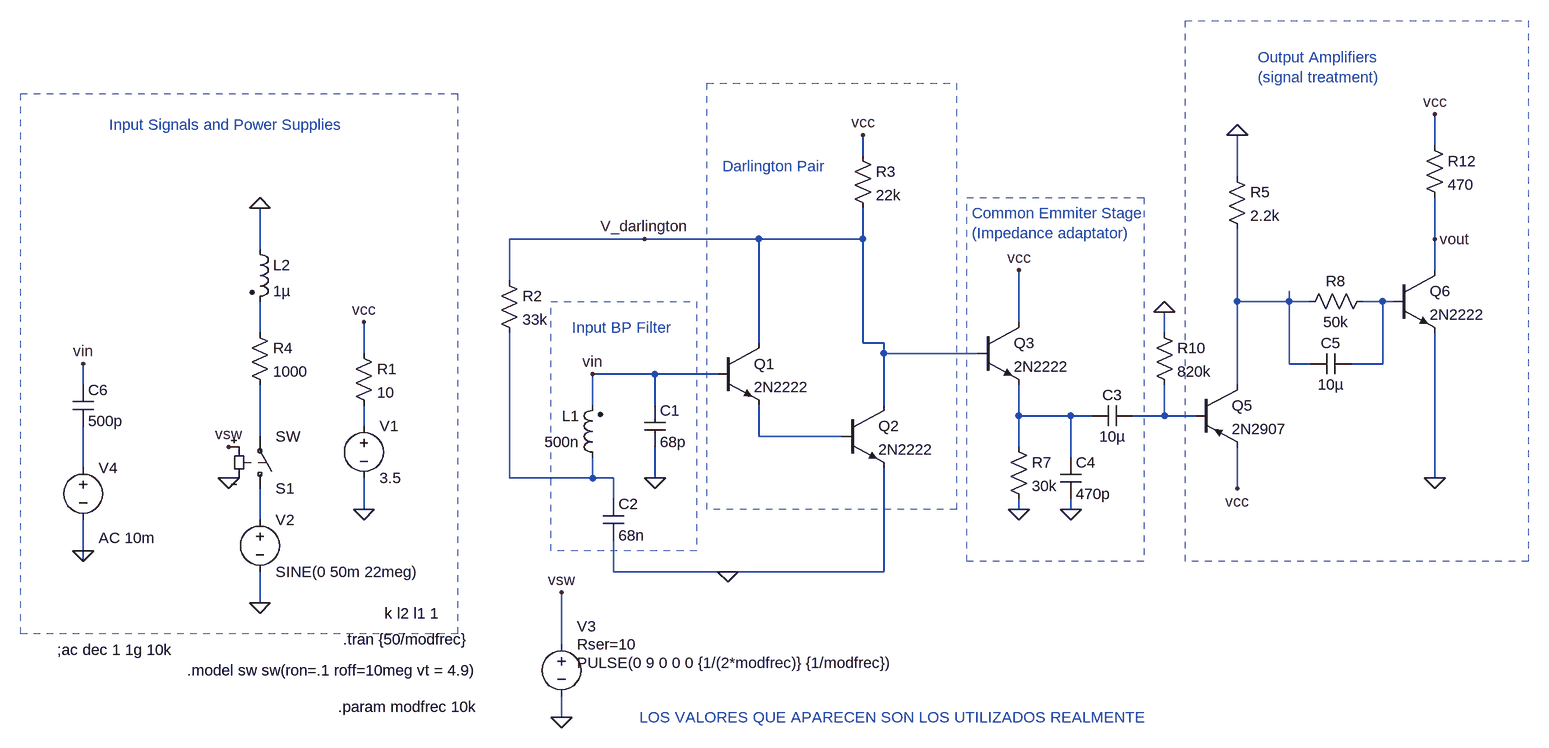
[diagram p0: schematic radio_2.asc]
radio_2.asc, the LTspice schematic file:
Version 4
SHEET 1 2164 724
WIRE 1088 -208 1088 -256
WIRE 208 -192 208 -224
WIRE 784 -160 784 -224
WIRE -128 -64 -336 -64
WIRE 48 -64 -128 -64
WIRE 208 -64 208 -112
WIRE 208 -64 48 -64
WIRE 1088 -64 1088 -128
WIRE -720 -48 -720 -112
WIRE 1088 -16 1088 -64
WIRE -336 0 -336 -64
WIRE 784 32 784 -80
WIRE 864 32 864 16
WIRE 864 32 784 32
WIRE 896 32 864 32
WIRE 1008 32 976 32
WIRE 1024 32 1008 32
WIRE 448 64 448 -16
WIRE -720 80 -720 32
WIRE 672 80 672 48
WIRE 48 96 48 -64
WIRE 208 96 208 -64
WIRE 240 96 208 96
WIRE -560 112 -560 64
WIRE 240 112 240 96
WIRE 384 112 240 112
WIRE 864 128 864 32
WIRE 896 128 864 128
WIRE 1008 128 1008 32
WIRE 1008 128 960 128
WIRE -112 144 -208 144
WIRE -16 144 -112 144
WIRE -992 160 -992 128
WIRE 784 160 784 32
WIRE -208 192 -208 144
WIRE -112 192 -112 144
WIRE 240 192 240 112
WIRE 448 208 448 160
WIRE 528 208 448 208
WIRE 560 208 528 208
WIRE 672 208 672 160
WIRE 672 208 624 208
WIRE 720 208 672 208
WIRE -560 224 -560 192
WIRE -720 240 -720 160
WIRE 48 240 48 192
WIRE 176 240 48 240
WIRE 448 256 448 208
WIRE 528 272 528 208
WIRE -992 288 -992 224
WIRE -336 304 -336 80
WIRE -208 304 -208 272
WIRE -208 304 -336 304
WIRE -176 304 -208 304
WIRE -112 304 -112 256
WIRE 1088 304 1088 80
WIRE 784 320 784 256
WIRE -176 336 -176 304
WIRE -560 352 -560 304
WIRE 448 352 448 336
WIRE 528 352 528 336
WIRE -720 368 -720 320
WIRE -992 416 -992 368
WIRE -992 432 -992 416
WIRE -176 448 -176 400
WIRE 0 448 -176 448
WIRE 240 448 240 288
WIRE 240 448 0 448
WIRE -720 496 -720 448
WIRE -256 560 -256 480
WIRE -256 672 -256 640
FLAG -560 352 0
FLAG -560 64 vcc
FLAG 208 -224 vcc
FLAG -720 496 0
FLAG -720 -112 0
FLAG 0 448 0
FLAG -256 672 0
FLAG -256 480 vsw
FLAG -768 304 0
FLAG -768 256 vsw
FLAG 448 352 0
FLAG -112 304 0
FLAG 448 -16 vcc
FLAG 672 48 0
FLAG 784 320 vcc
FLAG 784 -224 0
FLAG 1088 -256 vcc
FLAG 1088 304 0
FLAG 528 352 0
FLAG -992 416 0
FLAG -992 128 vin
FLAG -208 144 vin
FLAG 1088 -64 vout
FLAG -128 -64 V_darlington
SYMBOL npn -16 96 R0
SYMATTR InstName Q1
SYMATTR Value 2N2222
SYMBOL ind2 -192 288 R180
WINDOW 0 36 80 Left 2
WINDOW 3 36 40 Left 2
SYMATTR InstName L1
SYMATTR Value 500n
SYMATTR Type ind
SYMBOL cap -128 192 R0
SYMATTR InstName C1
SYMATTR Value 68p
SYMBOL voltage -560 208 R0
WINDOW 123 0 0 Left 0
WINDOW 39 0 0 Left 0
SYMATTR InstName V1
SYMATTR Value 3.5
SYMBOL res -576 96 R0
SYMATTR InstName R1
SYMATTR Value 10
SYMBOL res -352 -16 R0
SYMATTR InstName R2
SYMATTR Value 33k
SYMBOL res 192 -208 R0
SYMATTR InstName R3
SYMATTR Value 22k
SYMBOL npn 176 192 R0
SYMATTR InstName Q2
SYMATTR Value 2N2222
SYMBOL voltage -720 352 R0
WINDOW 123 0 0 Left 0
WINDOW 39 0 0 Left 0
SYMATTR InstName V2
SYMATTR Value SINE(0 50m 22meg)
SYMBOL res -736 64 R0
SYMATTR InstName R4
SYMATTR Value 1000
SYMBOL ind2 -736 -64 R0
SYMATTR InstName L2
SYMATTR Value 1µ
SYMATTR Type ind
SYMBOL voltage -256 544 R0
WINDOW 3 24 44 Left 2
WINDOW 123 0 0 Left 0
WINDOW 39 24 16 Left 2
WINDOW 0 24 -12 Left 2
SYMATTR Value PULSE(0 9 0 0 0 {1/(2*modfrec)} {1/modfrec})
SYMATTR SpiceLine Rser=10
SYMATTR InstName V3
SYMBOL sw -720 336 M180
SYMATTR InstName S1
SYMBOL npn 384 64 R0
SYMATTR InstName Q3
SYMATTR Value 2N2222
SYMBOL res 432 240 R0
SYMATTR InstName R7
SYMATTR Value 30k
SYMBOL res 768 -176 R0
SYMATTR InstName R5
SYMATTR Value 2.2k
SYMBOL cap 624 192 R90
WINDOW 0 0 32 VBottom 2
WINDOW 3 32 32 VTop 2
SYMATTR InstName C3
SYMATTR Value 10µ
SYMBOL res 656 64 R0
SYMATTR InstName R10
SYMATTR Value 820k
SYMBOL pnp 720 160 R0
SYMATTR InstName Q5
SYMATTR Value 2N2907
SYMBOL npn 1024 -16 R0
SYMATTR InstName Q6
SYMATTR Value 2N2222
SYMBOL res 1072 -224 R0
SYMATTR InstName R12
SYMATTR Value 470
SYMBOL cap -192 336 R0
SYMATTR InstName C2
SYMATTR Value 68n
SYMBOL cap 512 272 R0
SYMATTR InstName C4
SYMATTR Value 470p
SYMBOL res 992 16 R90
WINDOW 0 0 56 VBottom 2
WINDOW 3 32 56 VTop 2
SYMATTR InstName R8
SYMATTR Value 50k
SYMBOL cap 960 112 R90
WINDOW 0 0 32 VBottom 2
WINDOW 3 32 32 VTop 2
SYMATTR InstName C5
SYMATTR Value 10µ
SYMBOL voltage -992 272 R0
WINDOW 123 24 124 Left 2
WINDOW 39 0 0 Left 0
SYMATTR Value2 AC 10m
SYMATTR InstName V4
SYMATTR Value ""
SYMBOL cap -1008 160 R0
SYMATTR InstName C6
SYMATTR Value 500p
TEXT -528 512 Left 2 !k l2 l1 1
TEXT -592 552 Left 2 !.tran {50/modfrec}
TEXT -832 600 Left 2 !.model sw sw(ron=.1 roff=10meg vt = 4.9)
TEXT -136 672 Left 2 ;LOS VALORES QUE APARECEN SON LOS UTILIZADOS REALMENTE
TEXT -600 656 Left 2 !.param modfrec 10k
TEXT -1032 568 Left 2 !;ac dec 1 1g 10k
TEXT -952 -240 Left 2 ;Input Signals and Power Supplies
TEXT -240 72 Left 2 ;Input BP Filter
TEXT -8 -176 Left 2 ;Darlington Pair
TEXT 376 -104 Left 2 ;Common Emmiter Stage\n(Impedance adaptator)
TEXT 816 -344 Left 2 ;Output Amplifiers\n(signal treatment)
RECTANGLE Normal -416 544 -1088 -288 1
RECTANGLE Normal -48 416 -272 32 1
RECTANGLE Normal 352 352 -32 -304 1
RECTANGLE Normal 640 432 368 -128 1
RECTANGLE Normal 1232 432 704 -400 1

The netlist it stands for:
* radio_2.asc
Q1 V_darlington vin N008 0 2N2222
L1 N010 vin 500n
C1 vin 0 68p
V1 N006 0 3.5
R1 vcc N006 10
R2 V_darlington N010 33k
R3 vcc V_darlington 22k
Q2 V_darlington N008 0 0 2N2222
V2 N011 0 SINE(0 50m 22meg)
R4 N003 N007 1000
L2 0 N003 1µ
V3 vsw 0 PULSE(0 9 0 0 0 {1/(2*modfrec)} {1/modfrec}) Rser=10
S1 N011 N007 vsw 0 SW
Q3 vcc V_darlington N004 0 2N2222
R7 N004 0 30k
R5 0 N001 2.2k
C3 N005 N004 10µ
R10 0 N005 820k
Q5 N001 N005 vcc 0 2N2907
Q6 vout N002 0 0 2N2222
R12 vcc vout 470
C2 N010 0 68n
C4 N004 0 470p
R8 N002 N001 50k
C5 N002 N001 10µ
V4 N009 0 AC 10m
C6 vin N009 500p
.model NPN NPN
.model PNP PNP
.lib standard.bjt
k l2 l1 1
.tran {50/modfrec}
.model sw sw(ron=.1 roff=10meg vt = 4.9)
* LOS VALORES QUE APARECEN SON LOS UTILIZADOS REALMENTE
.param modfrec 10k
;ac dec 1 1g 10k
* Input Signals and Power Supplies
* Input BP Filter
* Darlington Pair
* Common Emmiter Stage
* (Impedance adaptator)
* Output Amplifiers
* (signal treatment)
.backanno
.end